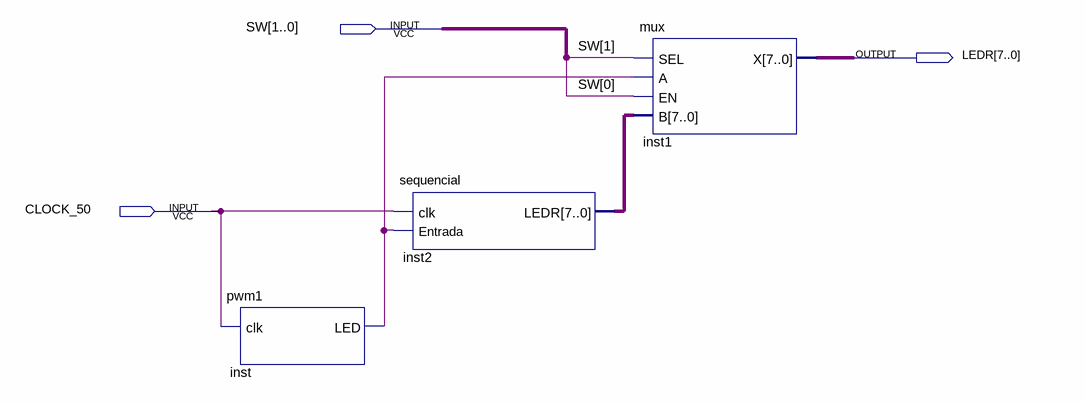
[diagram p0: schematic sheet]
// Quartus schematic exercicio_2.bdf as structural Verilog: 3 symbols, 3 pins
module exercicio_2 (
  input  [1:0] SW,
  input  CLOCK_50,
  output [7:0] LEDR
);

  wire inst_led;
  wire [7:0] inst2_ledr;

  pwm1 inst (.clk(CLOCK_50), .LED(inst_led));
  sequencial inst2 (.clk(CLOCK_50), .Entrada(inst_led), .LEDR(inst2_ledr));
  mux inst1 (.SEL(SW[1]), .A(inst_led), .EN(SW[0]), .B(inst2_ledr), .X(LEDR));
endmodule
